# Altium project Logic_Board_Rev_3.PrjPcb
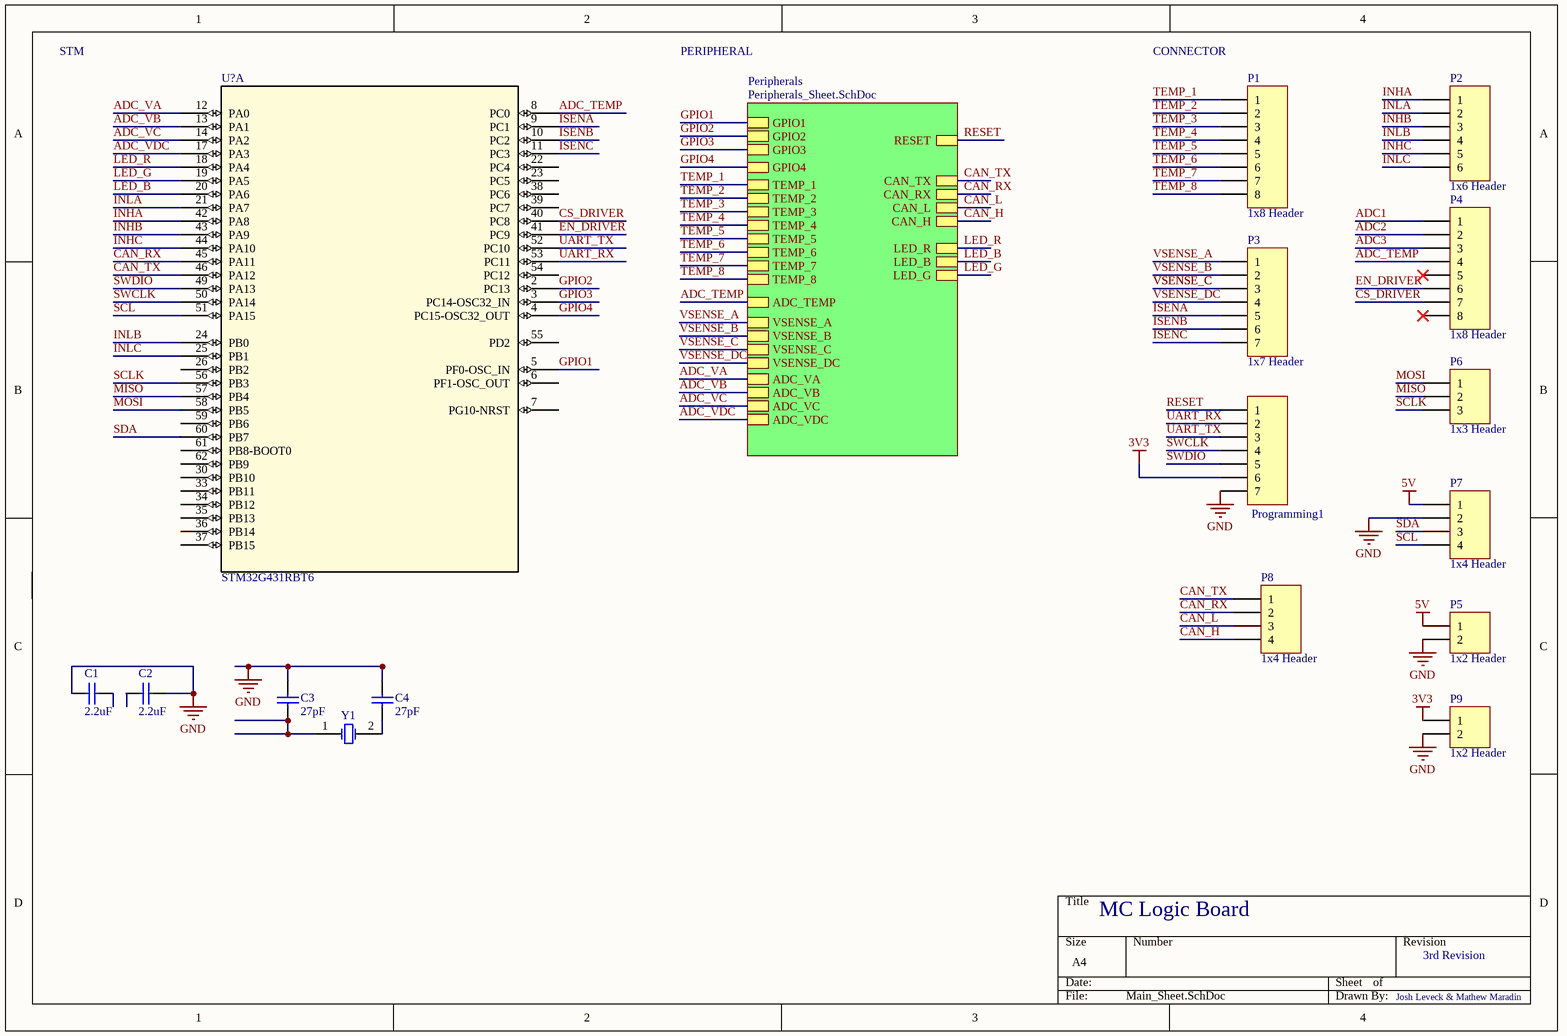
[diagram p0: Main_Sheet.SchDoc]
2 sheets, 65 parts. Net scope: hierarchical (ports join the sheet entries above them; power ports are global).
Board file: PCB1.PcbDoc
Sheets:
  Main_Sheet.SchDoc
    Peripherals = Peripherals_Sheet.SchDoc

## Sheet Main_Sheet.SchDoc
size A4; SheetNumber: 1; SheetTotal: 2

### Parts
(Parts that share a designator on the sheet are numbered #1, #2 ... from top to bottom, then left to right.)
C1  value 2.2uF  [0805 - Capacitor]  (hidden comment: Capacitor - Nonpolarized)
C2  value 2.2uF  [0805 - Capacitor]  (hidden comment: Capacitor - Nonpolarized)
C3  value 27pF  [0805 - Capacitor]  (hidden comment: 100V)
C4  value 27pF  [0805 - Capacitor]  (hidden comment: 100V)
P1  1x8 Header  [HDR1X8]
P2  1x6 Header  [HDR1X6]
P3  1x7 Header  [HDR1X7]
P4  1x8 Header  [HDR1X8]
P5  1x2 Header  [HDR1X2]
P6  1x3 Header  [HDR1X3]
P7  1x4 Header  [HDR1X4]
P8  1x4 Header  [HDR1X4]
P9  1x2 Header  [HDR1X2]
Programming1  Programming  [HDR1X7]  (value not drawn)
U1#1  STM32G431RBT6  [LQFP64-10x10mm]  (part A of 2)
Y1  Oscillator  [2-SMD NO LEAD CRSYSTAL]  (value not drawn)

### Sub-sheets
Peripherals = Peripherals_Sheet.SchDoc: GPIO1, GPIO2, GPIO3, TEMP_1, TEMP_2, TEMP_3, TEMP_4, TEMP_5, TEMP_6, TEMP_7, TEMP_8, ADC_TEMP, VSENSE_A, VSENSE_B, VSENSE_C, VSENSE_DC, ADC_VA, ADC_VB, ADC_VC, ADC_VDC, CAN_TX, CAN_RX, CAN_H, CAN_L, RESET, GPIO4, LED_R, LED_G, LED_B

### Nets
3V3: P9.1 Programming1.6
5V: P5.1 P7.1
GND: C1.1 C2.2 C3.2 C4.2 P5.2 P7.2 P9.2 Programming1.7
ADC1: P4.1
ADC2: P4.2
ADC3: P4.3
ADC_TEMP: P4.4 U1#1.8(PC0) ; sheet Peripherals/ADC_TEMP
ADC_VA: U1#1.12(PA0) ; sheet Peripherals/ADC_VA
ADC_VB: U1#1.13(PA1) ; sheet Peripherals/ADC_VB
ADC_VC: U1#1.14(PA2) ; sheet Peripherals/ADC_VC
ADC_VDC: U1#1.17(PA3) ; sheet Peripherals/ADC_VDC
CAN_H: P8.4 ; sheet Peripherals/CAN_H
CAN_L: P8.3 ; sheet Peripherals/CAN_L
CAN_RX: P8.2 U1#1.45(PA11) ; sheet Peripherals/CAN_RX
CAN_TX: P8.1 U1#1.46(PA12) ; sheet Peripherals/CAN_TX
CS_DRIVER: P4.7 U1#1.40(PC8)
EN_DRIVER: P4.6 U1#1.41(PC9)
GPIO1: U1#1.5(PF0-OSC_IN) ; sheet Peripherals/GPIO1
GPIO2: U1#1.2(PC13) ; sheet Peripherals/GPIO2
GPIO3: U1#1.3(PC14-OSC32_IN) ; sheet Peripherals/GPIO3
GPIO4: U1#1.4(PC15-OSC32_OUT) ; sheet Peripherals/GPIO4
INHA: P2.1 U1#1.42(PA8)
INHB: P2.3 U1#1.43(PA9)
INHC: P2.5 U1#1.44(PA10)
INLA: P2.2 U1#1.21(PA7)
INLB: P2.4 U1#1.24(PB0)
INLC: P2.6 U1#1.25(PB1)
ISENA: P3.5 U1#1.9(PC1)
ISENB: P3.6 U1#1.10(PC2)
ISENC: P3.7 U1#1.11(PC3)
LED_B: U1#1.20(PA6) ; sheet Peripherals/LED_B
LED_G: U1#1.19(PA5) ; sheet Peripherals/LED_G
LED_R: U1#1.18(PA4) ; sheet Peripherals/LED_R
MISO: P6.2 U1#1.57(PB4)
MOSI: P6.1 U1#1.58(PB5)
RESET: Programming1.1 ; sheet Peripherals/RESET
SCL: P7.4 U1#1.51(PA15)
SCLK: P6.3 U1#1.56(PB3)
SDA: P7.3 U1#1.60(PB7)
SWCLK: Programming1.4 U1#1.50(PA14)
SWDIO: Programming1.5 U1#1.49(PA13)
TEMP_1: P1.1 ; sheet Peripherals/TEMP_1
TEMP_2: P1.2 ; sheet Peripherals/TEMP_2
TEMP_3: P1.3 ; sheet Peripherals/TEMP_3
TEMP_4: P1.4 ; sheet Peripherals/TEMP_4
TEMP_5: P1.5 ; sheet Peripherals/TEMP_5
TEMP_6: P1.6 ; sheet Peripherals/TEMP_6
TEMP_7: P1.7 ; sheet Peripherals/TEMP_7
TEMP_8: P1.8 ; sheet Peripherals/TEMP_8
UART_RX: Programming1.2 U1#1.53(PC11)
UART_TX: Programming1.3 U1#1.52(PC10)
VSENSE_A: P3.1 ; sheet Peripherals/VSENSE_A
VSENSE_B: P3.2 ; sheet Peripherals/VSENSE_B
VSENSE_C: P3.3 ; sheet Peripherals/VSENSE_C
VSENSE_DC: P3.4 ; sheet Peripherals/VSENSE_DC
NetC3_1: C3.1 Y1.1(OSC1)
NetC4_1: C4.1 Y1.2(OSC2)

Not connected (* = marked no-connect by the designer): C1 2; C2 1; P4 5* 8*; U1#1 6(PF1-OSC_OUT) 7(PG10-NRST) 22(PC4) 23(PC5) 26(PB2) 30(PB10) 33(PB11) 34(PB12) 35(PB13) 36(PB14) 37(PB15) 38(PC6) 39(PC7) 54(PC12) 55(PD2) 59(PB6) 61(PB8-BOOT0) 62(PB9)

### Notes on the sheet
- STM
- PERIPHERAL
- CONNECTOR
- MC Logic Board
- 3rd Revision
- Josh Leveck & Mathew Maradin

### Library data of the parts
C1-C4 = Capacitor - Nonpolarized: Nonpolarized Capacitor; Supplier: *; Manufacturer: *; Rating: *; Manufacturer Part Number: *
  C1 C2: Supplier Part Number: 311-3420-1-ND
  C3 C4: Supplier Part Number: 311-1104-1-ND
P1 P4 = 1x8 Header: 1x8 Pin Header
P2 = 1x6 Header: 1x6 Pin Header
P3 Programming1 = 1x7 Header: 1x7 Pin Header
P5 P9 = 1x2 Header: 1x2 Pin Header
P6 = 1x3 Header: 1x3 Pin Header
P7 P8 = 1x4 Header: 1x4 Pin Header
U1#1 = STM32G431RBT6: No Description Available; Mfr_Name: STMicroelectronics; Copyright: Copyright (C) 2022 Ultra Librarian. All rights reserved.; Manufacturer_Part_Number: STM32G431RBT6; RefDes: RefDes; Type: DEV
Y1 = Oscillator: Crystal Oscillator; Value: 16MHz; Manufacturer Part Number: *; Manufacturer: *; Supplier Part Number: 535-13460-1-ND; Supplier: *; Rating: *

## Sheet Peripherals_Sheet.SchDoc
size A4; SheetNumber: 2; SheetTotal: 2
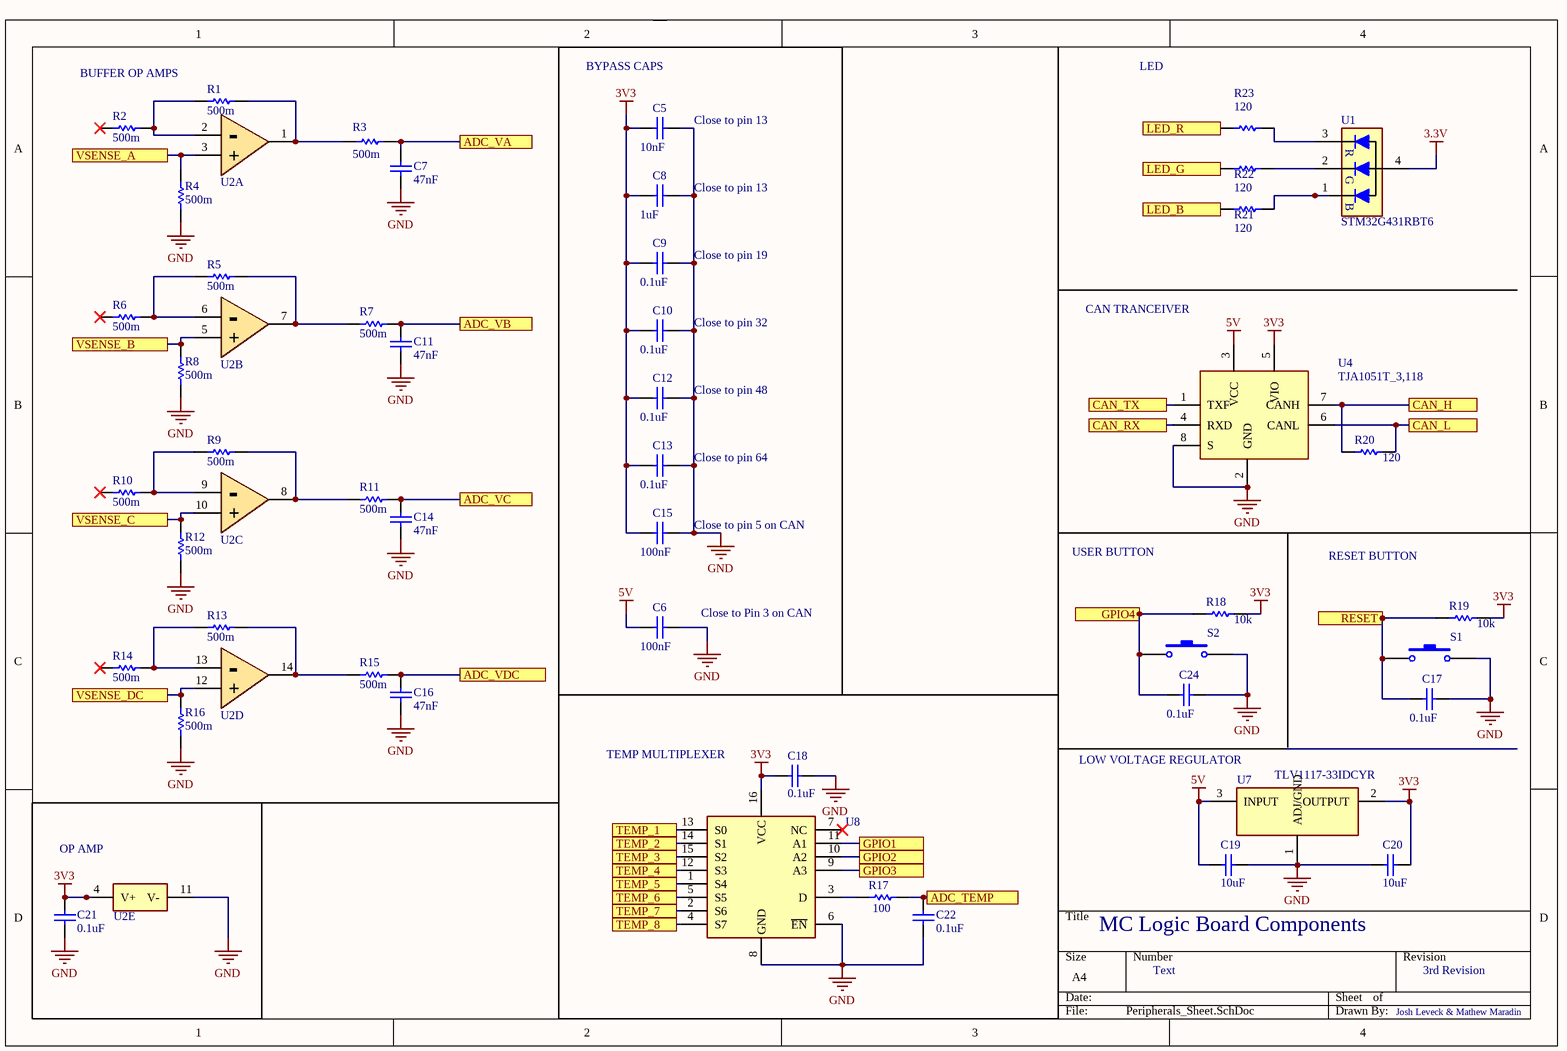
[diagram p1: Peripherals_Sheet.SchDoc]

### Parts
(Parts that share a designator on the sheet are numbered #1, #2 ... from top to bottom, then left to right.)
C5  value 10nF  [0805 - Capacitor]  (hidden comment: 10V)
C6  value 100nF  [0805 - Capacitor]  (hidden comment: Capacitor - Nonpolarized)
C7  value 47nF  [0805 - Capacitor]  (hidden comment: Capacitor - Nonpolarized)
C8  value 1uF  [0805 - Capacitor]  (hidden comment: 100V)
C9  value 0.1uF  [0805 - Capacitor]  (hidden comment: 100V)
C10  value 0.1uF  [0805 - Capacitor]  (hidden comment: 100V)
C11  value 47nF  [0805 - Capacitor]  (hidden comment: Capacitor - Nonpolarized)
C12  value 0.1uF  [0805 - Capacitor]  (hidden comment: 100V)
C13  value 0.1uF  [0805 - Capacitor]  (hidden comment: 100V)
C14  value 47nF  [0805 - Capacitor]  (hidden comment: Capacitor - Nonpolarized)
C15  value 100nF  [0805 - Capacitor]  (hidden comment: Capacitor - Nonpolarized)
C16  value 47nF  [0805 - Capacitor]  (hidden comment: Capacitor - Nonpolarized)
C17  value 0.1uF  [0805 - Capacitor]  (hidden comment: 100V)
C18  value 0.1uF  [0805 - Capacitor]  (hidden comment: Capacitor - Nonpolarized)
C19  value 10uF  [0805 - Capacitor]  (hidden comment: Capacitor - Nonpolarized)
C20  value 10uF  [0805 - Capacitor]  (hidden comment: Capacitor - Nonpolarized)
C21  value 0.1uF  [0805 - Capacitor]  (hidden comment: Capacitor - Nonpolarized)
C22  value 0.1uF  [0805 - Capacitor]  (hidden comment: Capacitor - Nonpolarized)
C24  value 0.1uF  [0805 - Capacitor]  (hidden comment: 100V)
R1  value 500m  [0603 - Resistor]  (hidden comment: Resistor)
R2  value 500m  [0603 - Resistor]  (hidden comment: Resistor)
R3  value 500m  [0603 - Resistor]  (hidden comment: Resistor)
R4  value 500m  [0603 - Resistor]  (hidden comment: Resistor)
R5  value 500m  [0603 - Resistor]  (hidden comment: Resistor)
R6  value 500m  [0603 - Resistor]  (hidden comment: Resistor)
R7  value 500m  [0603 - Resistor]  (hidden comment: Resistor)
R8  value 500m  [0603 - Resistor]  (hidden comment: Resistor)
R9  value 500m  [0603 - Resistor]  (hidden comment: Resistor)
R10  value 500m  [0603 - Resistor]  (hidden comment: Resistor)
R11  value 500m  [0603 - Resistor]  (hidden comment: Resistor)
R12  value 500m  [0603 - Resistor]  (hidden comment: Resistor)
R13  value 500m  [0603 - Resistor]  (hidden comment: Resistor)
R14  value 500m  [0603 - Resistor]  (hidden comment: Resistor)
R15  value 500m  [0603 - Resistor]  (hidden comment: Resistor)
R16  value 500m  [0603 - Resistor]  (hidden comment: Resistor)
R17  value 100  [0603 - Resistor]  (hidden comment: Resistor)
R18  10k  [0603 - Resistor]
R19  10k  [0603 - Resistor]
R20  value 120  [0603 - Resistor]  (hidden comment: 10k)
R21  value 120  [0603 - Resistor]  (hidden comment: 10k)
R22  value 120  [0603 - Resistor]  (hidden comment: 10k)
R23  value 120  [0603 - Resistor]  (hidden comment: 10k)
S1  Switch - Push Button  [6x6mm Switch]  (value not drawn)
S2  Switch - Push Button  [6x6mm Switch]  (value not drawn)
U1#2  STM32G431RBT6  [LQFP64-10x10mm]
U2  LM324AMX/NOPB  [LM324AMX/NOPB]  (value not drawn)  (parts A,B,C,D,E of 5)
U4  TJA1051T_3,118  [TJA1051T/3,118]
U7  TLV1117-33IDCYR  [TLV1117]
U8  NX3L4051PW,118  [SOP65P640X120-16N]  (value not drawn)

### Blocks framed on the sheet
OP AMP: C21 U2

### Ports
ADC_TEMP, ADC_VA, ADC_VB, ADC_VC, ADC_VDC, CAN_H, CAN_L, CAN_RX, CAN_TX, GPIO1, GPIO2, GPIO3, GPIO4, LED_B, LED_G, LED_R, RESET, TEMP_1, TEMP_2, TEMP_3, TEMP_4, TEMP_5, TEMP_6, TEMP_7, TEMP_8, VSENSE_A, VSENSE_B, VSENSE_C, VSENSE_DC

### Nets
3.3V: U1#2.4
3V3: C5.1 C8.1 C9.1 C10.1 C12.1 C13.1 C15.2 C18.1 C20.2 C21.1 R18.1 R19.1 U2.4(V+) U4.5(VIO) U7.2(OUTPUT) U8.16(VCC)
5V: C6.2 C19.2 U4.3(VCC) U7.3(INPUT)
GND: C5.2 C6.1 C7.1 C8.2 C9.2 C10.2 C11.1 C12.2 C13.2 C14.1 C15.1 C16.1 C17.2 C18.2 C19.1 C20.1 C21.2 C22.1 C24.2 R4.1 R8.1 R12.1 R16.1 S1.2 S2.2 U2.11(V-) U4.2(GND) U4.8(S) U7.1(ADJ/GND) U8.6(~{EN}) U8.8(GND)
ADC_TEMP: C22.2 R17.1 ; port ADC_TEMP
ADC_VA: C7.2 R3.2 ; port ADC_VA
ADC_VB: C11.2 R7.2 ; port ADC_VB
ADC_VC: C14.2 R11.2 ; port ADC_VC
ADC_VDC: C16.2 R15.2 ; port ADC_VDC
CAN_H: R20.2 U4.7(CANH) ; port CAN_H
CAN_L: R20.1 U4.6(CANL) ; port CAN_L
CAN_RX: U4.4(RXD) ; port CAN_RX
CAN_TX: U4.1(TXF) ; port CAN_TX
GPIO1: U8.11(A1) ; port GPIO1
GPIO2: U8.10(A2) ; port GPIO2
GPIO3: U8.9(A3) ; port GPIO3
GPIO4: C24.1 R18.2 S2.1 ; port GPIO4
LED_B: R21.2 ; port LED_B
LED_G: R22.2 ; port LED_G
LED_R: R23.2 ; port LED_R
RESET: C17.1 R19.2 S1.1 ; port RESET
TEMP_1: U8.13(S0) ; port TEMP_1
TEMP_2: U8.14(S1) ; port TEMP_2
TEMP_3: U8.15(S2) ; port TEMP_3
TEMP_4: U8.12(S3) ; port TEMP_4
TEMP_5: U8.1(S4) ; port TEMP_5
TEMP_6: U8.5(S5) ; port TEMP_6
TEMP_7: U8.2(S6) ; port TEMP_7
TEMP_8: U8.4(S7) ; port TEMP_8
VSENSE_A: R4.2 U2.3(+) ; port VSENSE_A
VSENSE_B: R8.2 U2.5(+) ; port VSENSE_B
VSENSE_C: R12.2 U2.10(+) ; port VSENSE_C
VSENSE_DC: R16.2 U2.12(+) ; port VSENSE_DC
NetR1_1: R1.1 R2.2 U2.2(-)
NetR1_2: R1.2 R3.1 U2.1
NetR5_1: R5.1 R6.2 U2.6(-)
NetR5_2: R5.2 R7.1 U2.7
NetR9_1: R9.1 R10.2 U2.9(-)
NetR9_2: R9.2 R11.1 U2.8
NetR13_1: R13.1 R14.2 U2.13(-)
NetR13_2: R13.2 R15.1 U2.14
NetR17_2: R17.2 U8.3(D)
NetR21_1: R21.1 U1#2.1
NetR22_1: R22.1 U1#2.2
NetR23_1: R23.1 U1#2.3

Not connected (* = marked no-connect by the designer): R2 1*; R6 1*; R10 1*; R14 1*; U8 7(NC)*

### Notes on the sheet
- BUFFER OP AMPS
- BYPASS CAPS
- (near C5) Close to pin 13
- LED
- (near C8) Close to pin 13
- (near C9) Close to pin 19
- (near C10) Close to pin 32
- CAN TRANCEIVER
- (near C12) Close to pin 48
- (near C13) Close to pin 64
- (near C15) Close to pin 5 on CAN
- USER BUTTON
- RESET BUTTON
- (near C6) Close to Pin 3 on CAN
- TEMP MULTIPLEXER
- LOW VOLTAGE REGULATOR
- MC Logic Board Components
- Text
- 3rd Revision
- Josh Leveck & Mathew Maradin
- (in symbol RGB LED- Common Anode) R; G; B

### Library data of the parts
C5-C22 C24 = Capacitor - Nonpolarized: Nonpolarized Capacitor; Supplier: *; Manufacturer: *; Rating: *; Manufacturer Part Number: *
  C5: Supplier Part Number: 311-1475-1-ND
  C6 C15: Supplier Part Number: 311-3420-1-ND
  C7 C11 C14 C16: Supplier Part Number: 311-1431-1-ND
  C8: Supplier Part Number: 311-1456-1-ND
  C9 C10 C12 C13 C17 C18 C21 C22 C24: Supplier Part Number: 311-1141-1-ND
  C19 C20: Supplier Part Number: 13-CC0805KFX7R6BB106CT-ND
R18-R23 = Resistor: Rating: *; Manufacturer Part Number: *; Manufacturer: *; Supplier Part Number: 311-10.0KHRCT-ND; Supplier: *
  R18 R19: Value: 10k
S1 S2 = Switch - Push Button: Push Button Switch; Supplier: *; Manufacturer Part Number: *; Manufacturer: *; Supplier Part Number: *; Rating: *; Value: *
U1#2 = RGB LED- Common Anode: Manufacturer Part Number: *; Manufacturer: *; Supplier Part Number: *; Supplier: *
U2 = LM324AMX/NOPB: Gen Purp 4Ch Opamp; Manufacturer: TI; Manufacturer Part Number: LM324AMX/NOPB; Supplier Part Number: LM324AMX/NOPBCT-ND; Supplier: Digikey; ComponentLink1Description: Datasheet; ComponentLink1URL: https://www.ti.com/lit/ds/symlink/lm124-n.pdf?HQS=dis-dk-null-digikeymode-dsf-pf-null-wwe&ts=1616555832552
U4 = TJA1051T_3,118: CAN Transceiver IC 4.5V-5.5V 250ns; Manufacturer: NXP; Manufacturer Part Number: TJA1051T/3,118; Supplier Part Number: 568-8684-1-ND; Supplier: Digikey; ComponentLink1Description: Datasheet; ComponentLink1URL: http://www.nxp.com/docs/en/data-sheet/TJA1051.pdf
U7 = TLV1117-33IDCYR: Linear Voltage Regulator IC 3.3V 800MA SOT223-4; Manufacturer: Texas Instruments; Manufacturer Part Number: TLV1117-33IDCYR; Supplier Part Number: 296-21112-1-ND; Supplier: Digikey; ComponentLink1Description: Datasheet; ComponentLink1URL: http://www.ti.com/lit/ds/symlink/tlv1117.pdf?HQS=TI-null-null-digikeymode-df-pf-null-wwe&ts=1590668900314
U8 = NX3L4051PW,118: 8:1 MUX; Manufacturer: NXP; Manufacturer Part Number: NX3L4051PW,118; Supplier Part Number: 568-12393-1-ND; Supplier: Digikey; ComponentLink1Description: Datsheet; ComponentLink1URL: https://www.nxp.com/docs/en/data-sheet/NX3L4051.pdf
R1-R17 = Resistor: Rating: *; Manufacturer Part Number: *; Manufacturer: *; Supplier: *
  R1-R16: Supplier Part Number: 13-RL0603JR-070R5LCT-ND
  R17: Supplier Part Number: 311-100HRCT-ND

## Nets that join several sheets
3V3: Main_Sheet (P9.1 Programming1.6), Peripherals_Sheet (16 pins)
5V: Main_Sheet (P5.1 P7.1), Peripherals_Sheet (C6.2 C19.2 U4.3 U7.3)
GND: Main_Sheet (8 pins), Peripherals_Sheet (31 pins)
ADC_TEMP: Main_Sheet (P4.4 U1#1.8), Peripherals_Sheet (C22.2 R17.1)
ADC_VA: Main_Sheet (U1#1.12), Peripherals_Sheet (C7.2 R3.2)
ADC_VB: Main_Sheet (U1#1.13), Peripherals_Sheet (C11.2 R7.2)
ADC_VC: Main_Sheet (U1#1.14), Peripherals_Sheet (C14.2 R11.2)
ADC_VDC: Main_Sheet (U1#1.17), Peripherals_Sheet (C16.2 R15.2)
CAN_H: Main_Sheet (P8.4), Peripherals_Sheet (R20.2 U4.7)
CAN_L: Main_Sheet (P8.3), Peripherals_Sheet (R20.1 U4.6)
CAN_RX: Main_Sheet (P8.2 U1#1.45), Peripherals_Sheet (U4.4)
CAN_TX: Main_Sheet (P8.1 U1#1.46), Peripherals_Sheet (U4.1)
GPIO1: Main_Sheet (U1#1.5), Peripherals_Sheet (U8.11)
GPIO2: Main_Sheet (U1#1.2), Peripherals_Sheet (U8.10)
GPIO3: Main_Sheet (U1#1.3), Peripherals_Sheet (U8.9)
GPIO4: Main_Sheet (U1#1.4), Peripherals_Sheet (C24.1 R18.2 S2.1)
LED_B: Main_Sheet (U1#1.20), Peripherals_Sheet (R21.2)
LED_G: Main_Sheet (U1#1.19), Peripherals_Sheet (R22.2)
LED_R: Main_Sheet (U1#1.18), Peripherals_Sheet (R23.2)
RESET: Main_Sheet (Programming1.1), Peripherals_Sheet (C17.1 R19.2 S1.1)
TEMP_1: Main_Sheet (P1.1), Peripherals_Sheet (U8.13)
TEMP_2: Main_Sheet (P1.2), Peripherals_Sheet (U8.14)
TEMP_3: Main_Sheet (P1.3), Peripherals_Sheet (U8.15)
TEMP_4: Main_Sheet (P1.4), Peripherals_Sheet (U8.12)
TEMP_5: Main_Sheet (P1.5), Peripherals_Sheet (U8.1)
TEMP_6: Main_Sheet (P1.6), Peripherals_Sheet (U8.5)
TEMP_7: Main_Sheet (P1.7), Peripherals_Sheet (U8.2)
TEMP_8: Main_Sheet (P1.8), Peripherals_Sheet (U8.4)
VSENSE_A: Main_Sheet (P3.1), Peripherals_Sheet (R4.2 U2.3)
VSENSE_B: Main_Sheet (P3.2), Peripherals_Sheet (R8.2 U2.5)
VSENSE_C: Main_Sheet (P3.3), Peripherals_Sheet (R12.2 U2.10)
VSENSE_DC: Main_Sheet (P3.4), Peripherals_Sheet (R16.2 U2.12)